# EAGLE design scematics (EAGLE 9.6.2)
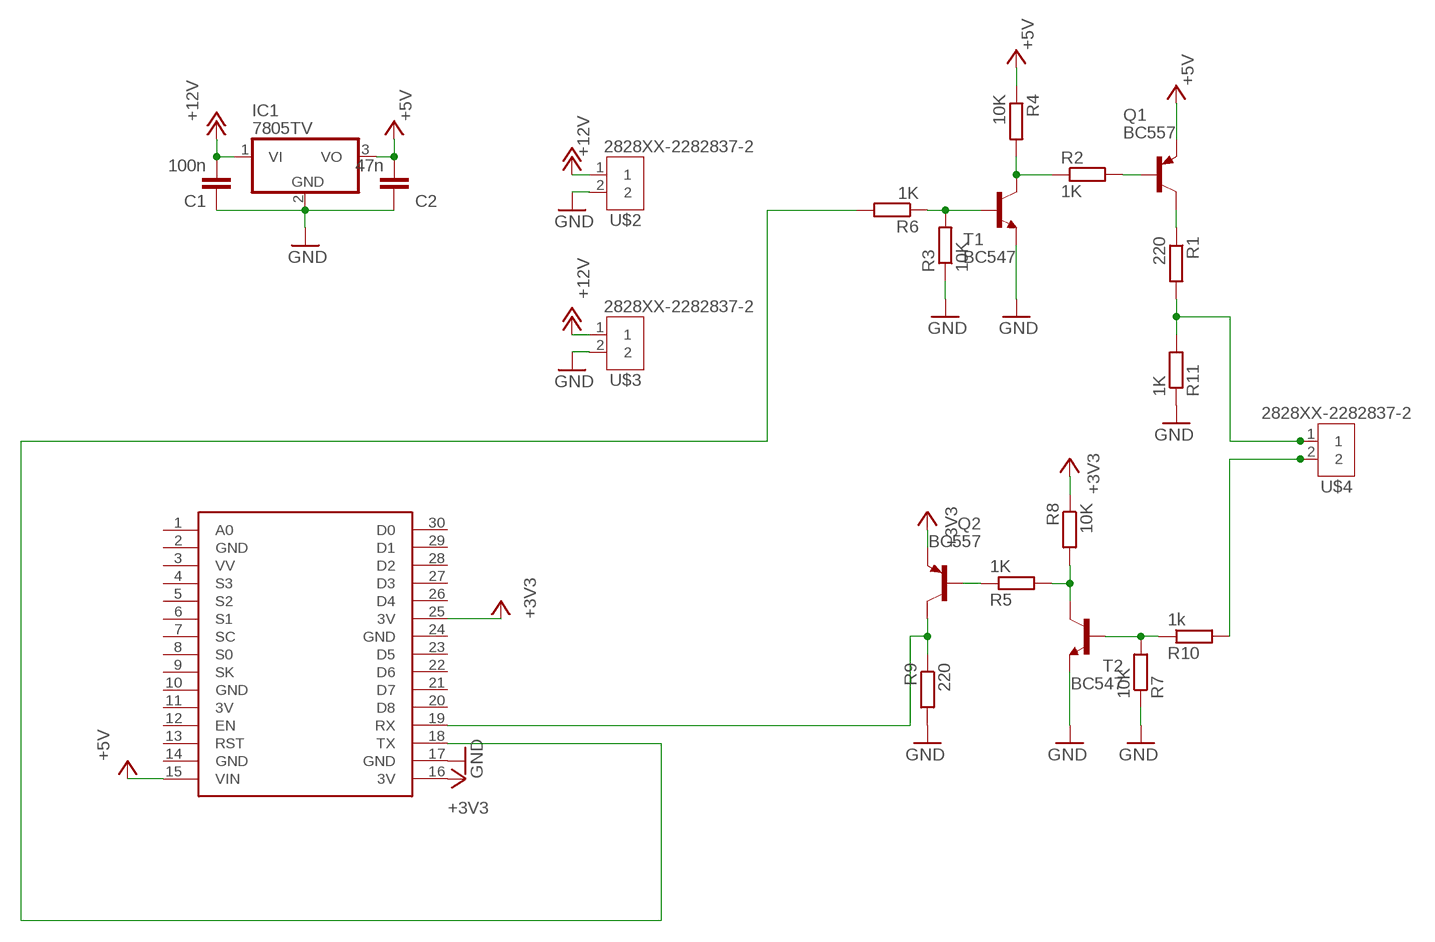
[diagram p0: schematic, sheet 1]

## Parts
C1  100n  C-EU050-025X075  [C050-025X075]
C2  47n  C-EU050-025X075  [C050-025X075]
IC1  7805TV  [TO220V]
Q1  BC557  [TO92]
Q2  BC557  [TO92]
R1  220  R-EU_0207/10  [0207/10]
R2  1K  R-EU_0207/10  [0207/10]
R3  10K  R-EU_0207/10  [0207/10]
R4  10K  R-EU_0207/10  [0207/10]
R5  1K  R-EU_0207/10  [0207/10]
R6  1K  R-EU_0207/10  [0207/10]
R7  10K  R-EU_0207/10  [0207/10]
R8  10K  R-EU_0207/10  [0207/10]
R9  220  R-EU_0207/10  [0207/10]
R10  1k  R-EU_0207/10  [0207/10]
R11  1K  R-EU_0207/10  [0207/10]
T1  BC547  [TO92]
T2  BC547  [TO92]
U$1  NODEMCU  [NODEMCU]
U$2  2828XX-2282837-2  [TERMBLK_508-2N]
U$3  2828XX-2282837-2  [TERMBLK_508-2N]
U$4  2828XX-2282837-2  [TERMBLK_508-2N]

## Nets
+3V3: Q2.1(E) R8.1 U$1.16(3V) U$1.25(3V)
+5V: C2.2 IC1.3(VO) Q1.1(E) R4.1 U$1.15(VIN)
+12V: C1.2 IC1.1(VI) U$2.1 U$3.1
GND: C1.1 C2.1 IC1.2(GND) R3.1 R7.1 R9.2 R11.1 T1.1(E) T2.1(E) U$1.17(GND) U$2.2 U$3.2
N$1: Q1.2(B) R2.2
N$2: R3.2 R6.1 T1.2(B)
N$3: R2.1 R4.2 T1.3(C)
N$4: Q1.3(C) R1.1
N$5: Q2.2(B) R5.1
N$6: R7.2 R10.1 T2.2(B)
N$7: R5.2 R8.2 T2.3(C)
N$8: Q2.3(C) R9.1 U$1.19(RX)
N$9: R10.2 U$4.2
N$11: R1.2 R11.2 U$4.1
N$12: R6.2 U$1.18(TX)
Unconnected: U$1.1(A0) U$1.3(VV) U$1.4(S3) U$1.5(S2) U$1.6(S1) U$1.7(SC) U$1.8(S0) U$1.9(SK) U$1.12(EN) U$1.13(RST) U$1.20(D8) U$1.21(D7) U$1.22(D6) U$1.23(D5) U$1.26(D4) U$1.27(D3) U$1.28(D2) U$1.29(D1) U$1.30(D0)

## Power pins joined to a net without a drawn wire
3V: U$1.11(3V)
GND: U$1.2(GND) U$1.10(GND) U$1.14(GND) U$1.24(GND)

## Library data of the parts
C1 C2 = resistor:C-EU: CAPACITOR, European symbol
IC1 = linear:78*: Positive VOLTAGE REGULATOR Source: http://cache.national.com/ds/LM/LM78L05.pdf http://www.fairchildsemi.com/ds/LM/LM7805.pdf
Q1 Q2 = transistor-pnp:BC557: PNP Transistor
R1-R11 = resistor:R-EU_: RESISTOR, European symbol
T1 T2 = transistor:BC547: NPN TRANSISTOR
U$1 = nodemcu:NODEMCU
U$2-U$4 = Connector:2828XX-2: 2 Position Wire to Board Terminal Block Horizontal with Board Datasheet <https://www.te.com.cn/commerce/DocumentDelivery/DDEController?Action=showdoc&DocId=Catalog+Section%7F1308389_EUROSTYLE_TERMINAL_BLOCKS%7F0607%7Fpdf%7FEnglish%7FENG_CS_1308389_EUROSTYLE_TERMINAL_BLOCKS_0607.pdf%7F2-282837-5>; CATEGORY: Connector; DESCRIPTION: 2 Position Wire to Board Terminal Block Horizontal with Board 5.08 mm Through Hole; MANUFACTURER: TE Connectivity; MPN: 282837-2; OPERATING_TEMPERATURE: -40°C to +105°C; PART_STATUS: ACTIVE; ROHS_COMPLIANCE: RoHS Compliant; SERIES: 282837; SUBCATEGORY: Terminal Block; TYPE: Side Wire Entry

## Board
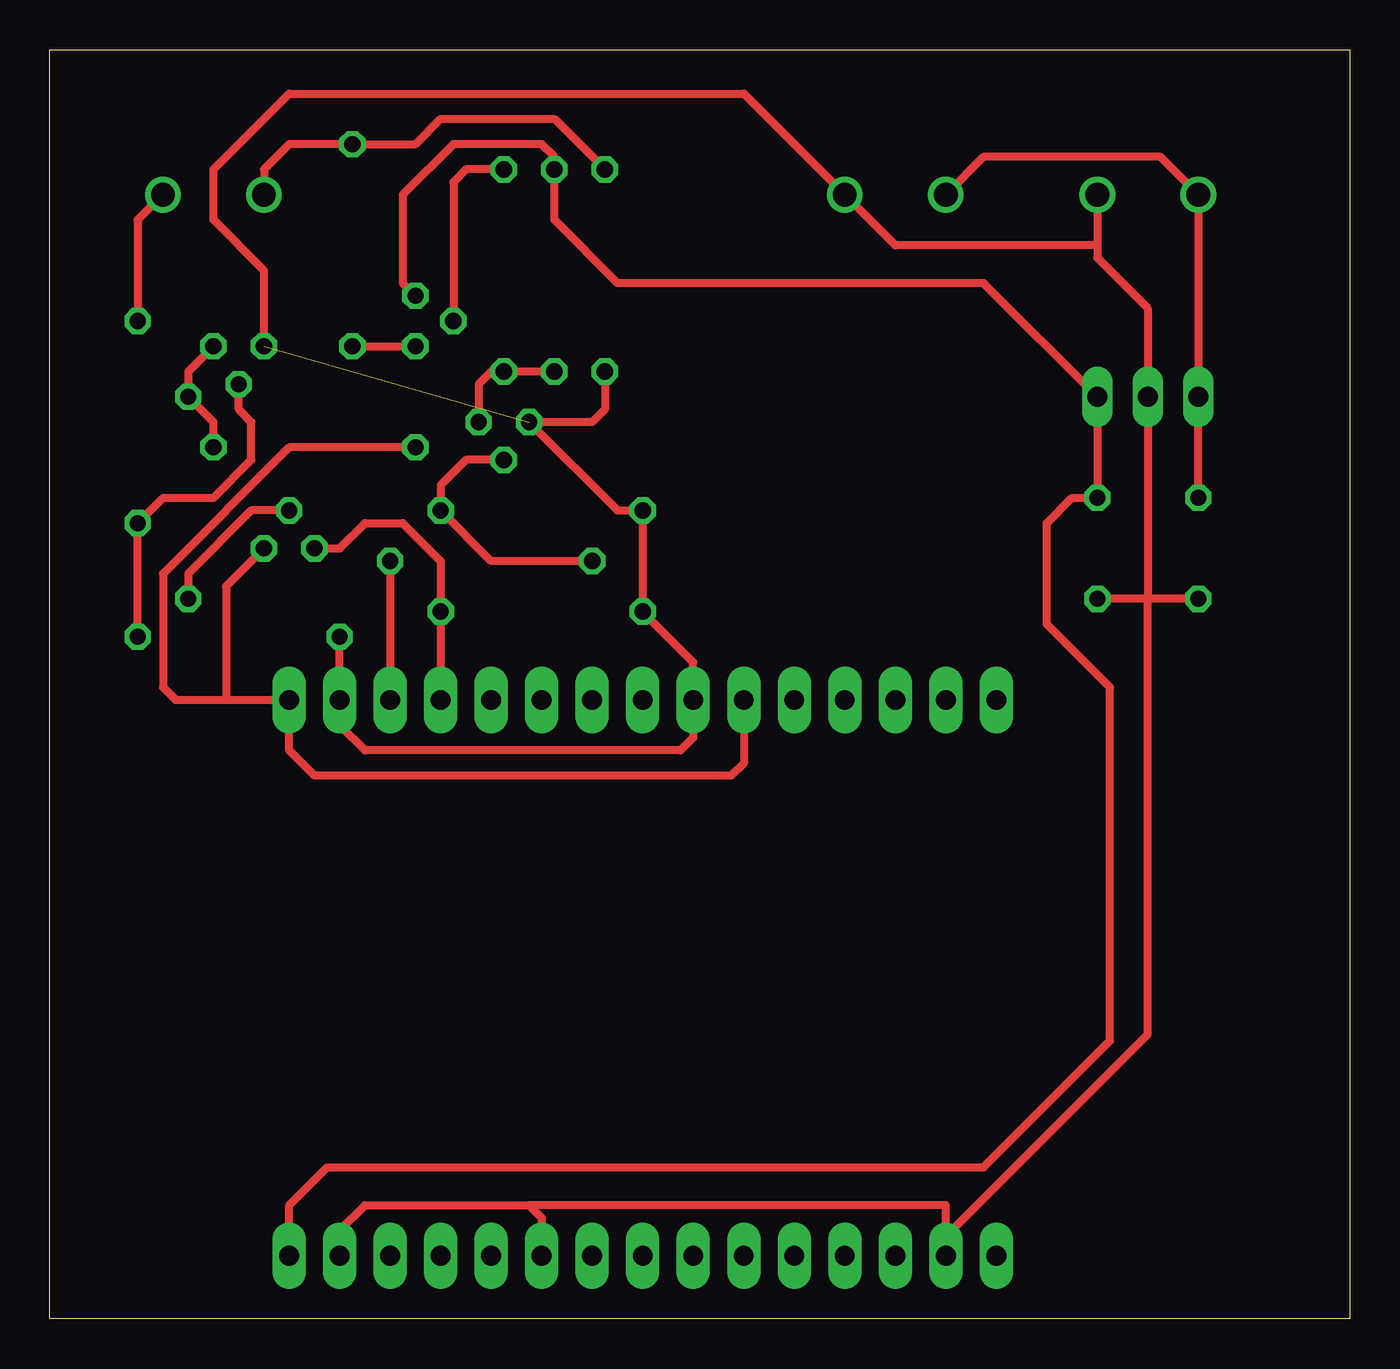
[diagram p1: board, top side]
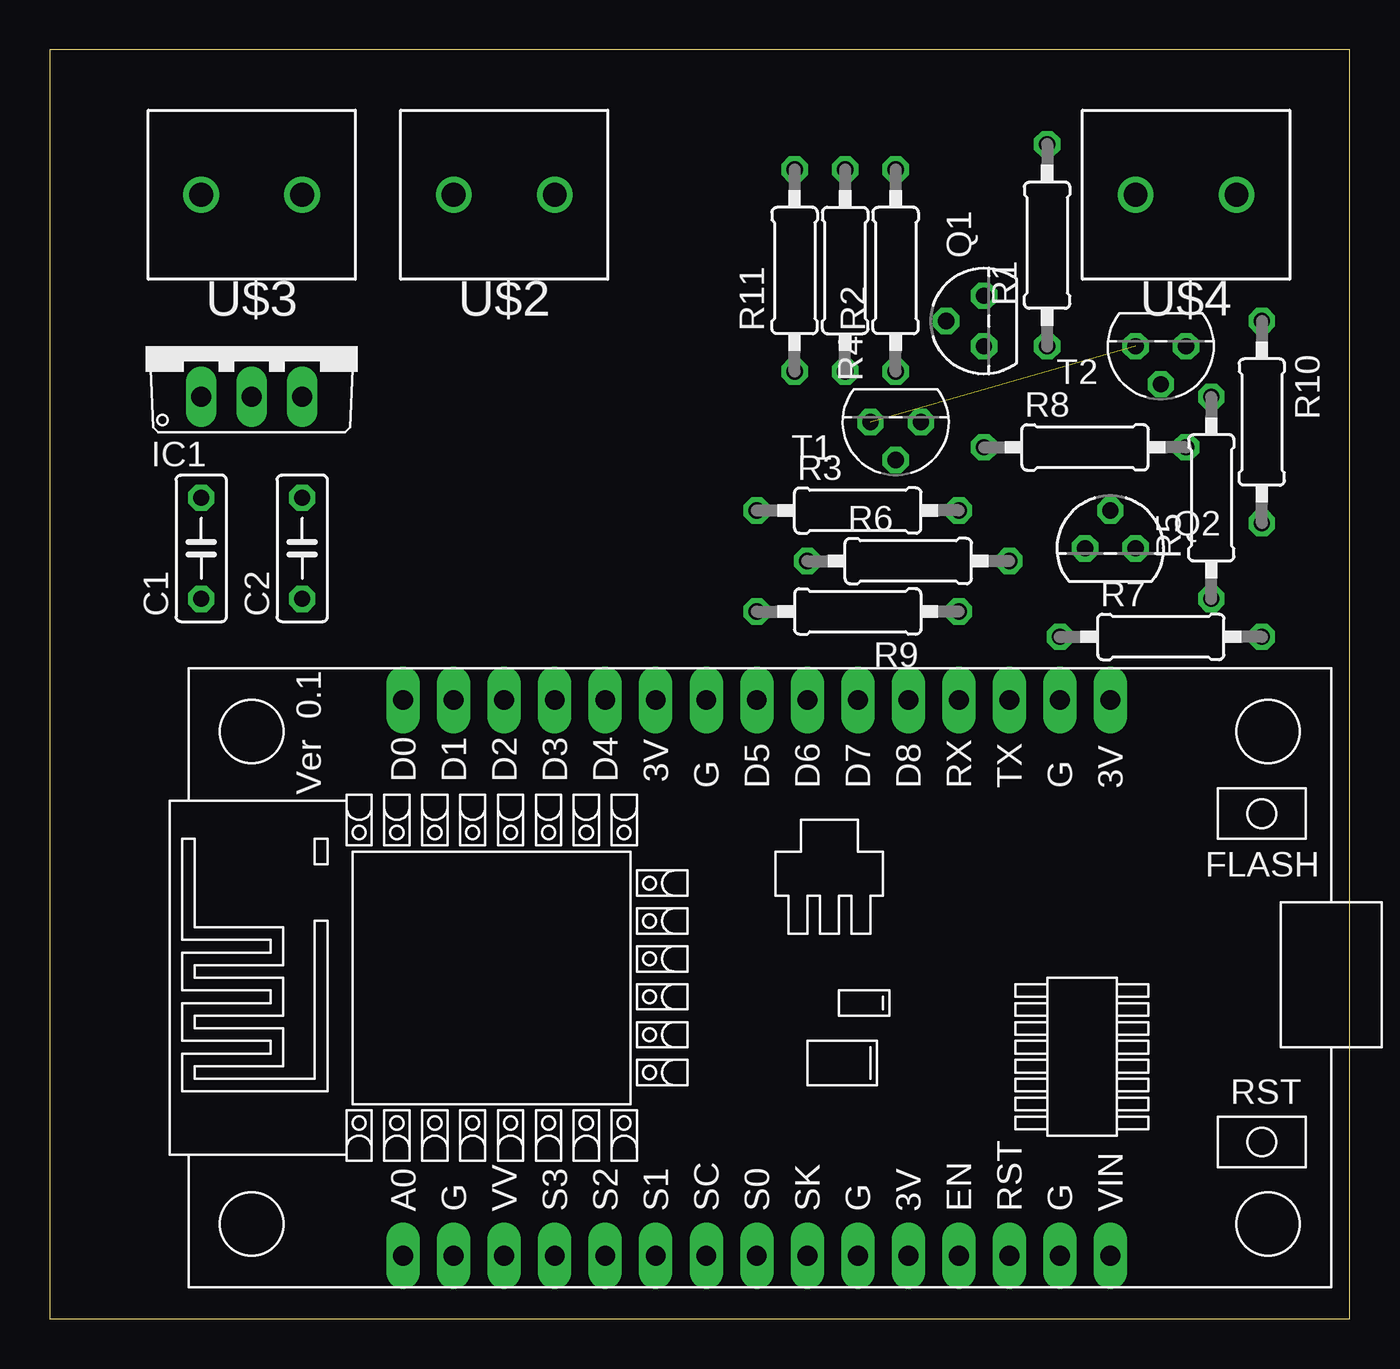
[diagram p2: board, bottom side, seen from below]

Size 65.39 x 63.8 mm. Coordinates in mm from the lower left corner, seen from the top.
Outline: 65.39,0 0,0 0,63.8 65.39,63.8 65.39,0
Copper layers (1*16): Top 0.035mm / dielectric 1.5mm / Bottom 0.035mm
Design rules "default *": minimum track width 0.4mm, minimum drill 0.8mm, track to track 0.4mm, track to pad 0.4mm, pad to pad 0.4mm, via to via 0.4mm, smd to smd 0.4mm, copper to edge 40mil, drill to drill 0.4mm, minimum pad ring 10mil, minimum via ring 8mil, stop-mask expansion 4mil, vias tented up to drill 0mil, thermal gap 10mil

### Footprints (pad centres in the part's own frame; a part is rotated, then mirrored left to right if it is on the bottom)
C050-025X075 = drill 0.813 octagon: 1 -2.54,0; 2 2.54,0
TO220V = drill 1.016 long: 1 -2.54,-2.54; 2 0,-2.54; 3 2.54,-2.54
TO92 = drill 0.813 octagon: 1 1.27,0; 2 0,1.905; 3 -1.27,0
0207/10 = drill 0.813 octagon: 1 -5.08,0; 2 5.08,0
NODEMCU = drill 1 pad 1.676 long: 1 -13.97,17.78; 2 -13.97,15.24; 3 -13.97,12.7; 4 -13.97,10.16; 5 -13.97,7.62; 6 -13.97,5.08; 7 -13.97,2.54; 8 -13.97,0; 9 -13.97,-2.54; 10 -13.97,-5.08; 11 -13.97,-7.62; 12 -13.97,-10.16; 13 -13.97,-12.7; 14 -13.97,-15.24; 15 -13.97,-17.78; 16 13.97,-17.78; 17 13.97,-15.24; 18 13.97,-12.7; 19 13.97,-10.16; 20 13.97,-7.62; 21 13.97,-5.08; 22 13.97,-2.54; 23 13.97,0; 24 13.97,2.54; 25 13.97,5.08; 26 13.97,7.62; 27 13.97,10.16; 28 13.97,12.7; 29 13.97,15.24; 30 13.97,17.78
TERMBLK_508-2N = drill 1.2: 1 0,0; 2 5.08,0

### Placement (x,y rotation side)
C1  57.76,38.73 90 bottom
C2  52.68,38.73 90 bottom
IC1  55.22,48.9 0 bottom
Q1  18.39,50.16 90 bottom
Q2  12.04,38.73 0 bottom
R1  15.22,53.98 90 bottom
R2  22.84,52.7 90 bottom
R3  24.75,40.64 0 bottom
R4  25.38,52.7 270 bottom
R5  6.97,41.27 90 bottom
R6  22.21,38.1 0 bottom
R7  9.51,34.29 0 bottom
R8  13.32,43.81 0 bottom
R9  24.75,35.56 180 bottom
R10  4.43,45.09 90 bottom
R11  27.92,52.7 90 bottom
T1  22.84,45.09 180 bottom
T2  9.51,48.9 180 bottom
U$1  29.82,17.14 90 bottom
U$2  45.06,56.52 0 bottom
U$3  57.76,56.52 0 bottom
U$4  10.78,56.52 0 bottom

### Tracks (layer width: path | path; a pad name or v marks a point on that pad's centre or on a via)
+3V3
  Top 0.4: R8.1 12.04,43.81 5.7,37.47 5.7,31.75 6.33,31.11 8.87,31.11 | 8.87,31.11 U$1.16 12.04,28.57 13.32,27.3 34.27,27.3 34.9,27.94 U$1.25 | Q2.1 8.87,36.83 8.87,31.11
+5V
  Top 0.4: Q1.1 17.76,52.07 17.76,56.52 20.3,59.05 24.75,59.05 25.38,58.42 R4.1 25.38,55.24 28.55,52.07 46.97,52.07 IC1.3 C2.2 51.41,41.27 50.14,40.01 50.14,34.92 53.32,31.75 53.32,13.97 46.97,7.62 13.95,7.62 12.04,5.71 U$1.15
+12V
  Top 0.4: U$2.1 46.97,58.42 55.86,58.42 U$3.1 IC1.1 C1.2
GND  (1 unrouted)
  Top 0.4: R7.1 U$1.17 14.59,29.84 15.86,28.57 31.73,28.57 32.36,29.21 U$1.24 32.36,33.02 R9.2 R3.1 28.55,40.64 T1.1 27.29,45.09 27.92,45.72 R11.1 | U$3.2 52.68,53.98 | 52.68,53.98 52.68,53.34 55.22,50.8 IC1.2 55.22,36.2 | 52.68,53.98 42.52,53.98 U$2.2 34.9,61.59 12.04,61.59 8.24,57.78 8.24,55.24 10.78,52.7 T2.1 | 55.22,36.2 C2.1 | C1.1 55.22,36.2 | U$1.2 45.06,3.81 45.06,4.14 55.22,14.3 55.22,36.2
  Top 0.406: U$1.14 14.59,4.45 15.86,5.71 24.11,5.71 | 24.11,5.71 24.75,5.08 U$1.10 | 45.06,3.81 45.06,5.71 24.11,5.71
N$1
  Top 0.4: Q1.2 20.3,57.15 20.93,57.78 R2.2
N$2
  Top 0.4: R6.1 22.21,38.1 R3.2 19.66,41.91 20.93,43.18 T1.2
N$3
  Top 0.4: R4.2 R2.1 22.21,47.62 21.57,46.99 T1.3
N$4
  Top 0.4: R1.1 Q1.3
N$5
  Top 0.4: Q2.2 10.14,40.64 6.97,37.47 R5.1
N$6
  Top 0.4: T2.2 9.51,45.72 10.14,45.09 10.14,43.18 8.24,41.27 5.7,41.27 R10.1 R7.2
N$7
  Top 0.4: T2.3 6.97,47.62 R5.2 8.24,45.09 R8.2
N$8
  Top 0.4: Q2.3 14.59,38.73 15.86,40.01 17.76,40.01 19.66,38.1 R9.1 U$1.19
N$9
  Top 0.4: U$4.2 4.43,55.24 R10.2
N$11
  Top 0.4: U$4.1 10.78,57.78 12.04,59.05 R1.2 18.39,59.05 19.66,60.33 25.38,60.33 R11.2
N$12
  Top 0.4: R6.2 U$1.18

### Text on the board
bValues: Michael / Hohenstein / 28.04.2021